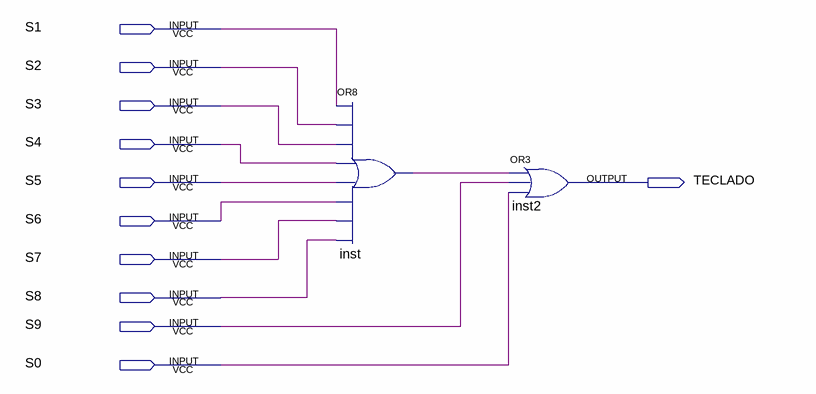
[diagram p0: schematic sheet]
// Quartus schematic or_teclado.bdf as structural Verilog: 2 symbols, 11 pins
module or_teclado (
  input  S1,
  input  S2,
  input  S3,
  input  S4,
  input  S5,
  input  S6,
  input  S7,
  input  S8,
  input  S9,
  input  S0,
  output TECLADO
);

  wire inst_out;

  or inst (inst_out, S1, S2, S3, S4, S5, S6, S7, S8);
  or inst2 (TECLADO, inst_out, S9, S0);
endmodule
